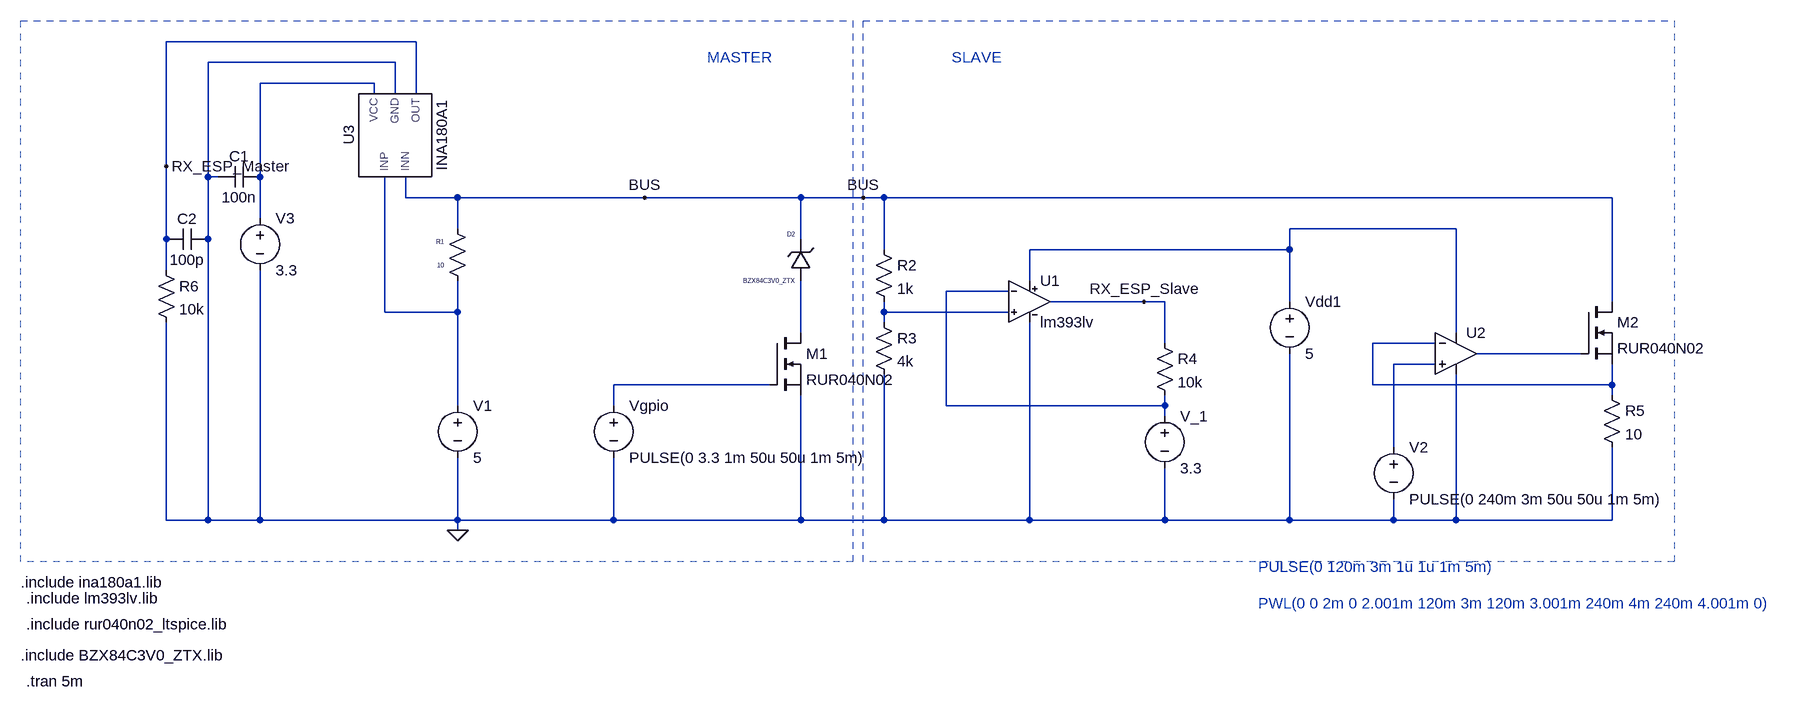
[diagram p0: schematic Master_Slave_INA180A1.asc]
Master_Slave_INA180A1.asc, the LTspice schematic file:
Version 4.1
SHEET 1 2420 728
WIRE -16 -288 -400 -288
WIRE -48 -256 -336 -256
WIRE -80 -224 -256 -224
WIRE -80 -208 -80 -224
WIRE -48 -208 -48 -256
WIRE -16 -208 -16 -288
WIRE -400 -96 -400 -288
WIRE -336 -80 -336 -256
WIRE -320 -80 -336 -80
WIRE -256 -80 -256 -224
WIRE -32 -48 -32 -80
WIRE 48 -48 -32 -48
WIRE 336 -48 48 -48
WIRE 576 -48 336 -48
WIRE 672 -48 576 -48
WIRE 704 -48 672 -48
WIRE 1824 -48 704 -48
WIRE -256 -16 -256 -80
WIRE 48 0 48 -48
WIRE 1584 0 1328 0
WIRE -400 16 -400 -96
WIRE -336 16 -336 -80
WIRE 576 16 576 -48
WIRE 704 32 704 -48
WIRE 1328 32 1328 0
WIRE 1328 32 928 32
WIRE -400 64 -400 16
WIRE 928 80 928 32
WIRE 896 96 800 96
WIRE 1104 112 960 112
WIRE 1136 112 1104 112
WIRE 1328 112 1328 32
WIRE 1824 112 1824 -48
WIRE -64 128 -64 -80
WIRE 48 128 48 80
WIRE 48 128 -64 128
WIRE 704 128 704 112
WIRE 896 128 704 128
WIRE 704 144 704 128
WIRE 576 160 576 80
WIRE 1584 160 1584 0
WIRE 1136 176 1136 112
WIRE 1552 176 1456 176
WIRE 1776 192 1616 192
WIRE 1552 208 1488 208
WIRE 528 240 288 240
WIRE 1456 240 1456 176
WIRE 1824 240 1824 208
WIRE 1824 240 1456 240
WIRE 1824 256 1824 240
WIRE 48 272 48 128
WIRE 288 272 288 240
WIRE 800 272 800 96
WIRE 1136 272 1136 256
WIRE 1136 272 800 272
WIRE 1136 288 1136 272
WIRE 1488 336 1488 208
WIRE -400 448 -400 144
WIRE -336 448 -336 16
WIRE -336 448 -400 448
WIRE -256 448 -256 64
WIRE -256 448 -336 448
WIRE 48 448 48 352
WIRE 48 448 -256 448
WIRE 288 448 288 352
WIRE 288 448 48 448
WIRE 576 448 576 256
WIRE 576 448 288 448
WIRE 704 448 704 224
WIRE 704 448 576 448
WIRE 928 448 928 144
WIRE 928 448 704 448
WIRE 1136 448 1136 368
WIRE 1136 448 928 448
WIRE 1328 448 1328 192
WIRE 1328 448 1136 448
WIRE 1488 448 1488 416
WIRE 1488 448 1328 448
WIRE 1584 448 1584 224
WIRE 1584 448 1488 448
WIRE 1824 448 1824 336
WIRE 1824 448 1584 448
WIRE 48 464 48 448
FLAG 48 464 0
FLAG 336 -48 BUS
FLAG -400 -96 RX_ESP_Master
FLAG 672 -48 BUS
FLAG 1104 112 RX_ESP_Slave
SYMBOL voltage 48 256 R0
SYMATTR InstName V1
SYMATTR Value 5
SYMBOL res 64 96 R180
WINDOW 0 36 76 Left 0
WINDOW 3 36 40 Left 0
SYMATTR InstName R1
SYMATTR Value 10
SYMBOL lib\\sym\\EIT_Semiconductors\\nmos 528 160 R0
SYMATTR InstName M1
SYMATTR Value RUR040N02
SYMATTR Prefix X
SYMBOL voltage 288 256 R0
SYMATTR Value PULSE(0 3.3 1m 50u 50u 1m 5m)
SYMATTR InstName Vgpio
SYMBOL zener 592 80 R180
WINDOW 0 24 72 Left 0
WINDOW 3 24 0 Left 0
SYMATTR InstName D2
SYMATTR Value BZX84C3V0_ZTX
SYMBOL voltage 1328 96 R0
SYMATTR InstName Vdd1
SYMATTR Value 5
SYMBOL voltage 1136 272 R0
SYMATTR InstName V_1
SYMATTR Value 3.3
SYMBOL res 688 16 R0
SYMATTR InstName R2
SYMATTR Value 1k
SYMBOL res 688 128 R0
SYMATTR InstName R3
SYMATTR Value 4k
SYMBOL res 1120 160 R0
SYMATTR InstName R4
SYMATTR Value 10k
SYMBOL LM393 928 112 R0
SYMATTR InstName U1
SYMATTR Value lm393lv
SYMATTR SpiceModel ""
SYMBOL lib\\sym\\EIT_Semiconductors\\nmos 1776 112 R0
SYMATTR InstName M2
SYMATTR Value RUR040N02
SYMATTR Prefix X
SYMBOL res 1808 240 R0
SYMATTR InstName R5
SYMATTR Value 10
SYMBOL lib\\sym\\Opamps\\UniversalOpamp2 1584 192 R0
SYMATTR InstName U2
SYMBOL voltage 1488 320 R0
SYMATTR InstName V2
SYMATTR Value PULSE(0 240m 3m 50u 50u 1m 5m)
SYMBOL INA180A1 -48 -144 R270
SYMATTR InstName U3
SYMBOL voltage -256 -32 R0
SYMATTR InstName V3
SYMATTR Value 3.3
SYMBOL res -416 48 R0
SYMATTR InstName R6
SYMATTR Value 10k
SYMBOL cap -256 -96 R90
WINDOW 0 0 32 VBottom 2
WINDOW 3 32 32 VTop 2
SYMATTR InstName C1
SYMATTR Value 100n
SYMBOL cap -400 32 R270
WINDOW 0 32 32 VTop 2
WINDOW 3 0 32 VBottom 2
SYMATTR InstName C2
SYMATTR Value 100p
TEXT -616 608 Left 2 !.include rur040n02_ltspice.lib
TEXT -624 656 Left 2 !.include BZX84C3V0_ZTX.lib
TEXT -616 696 Left 2 !.tran 5m
TEXT 1280 520 Left 2 ;PULSE(0 120m 3m 1u 1u 1m 5m)
TEXT 1280 576 Left 2 ;PWL(0 0 2m 0 2.001m 120m 3m 120m 3.001m 240m 4m 240m 4.001m 0)
TEXT -616 568 Left 2 !.include lm393lv.lib
TEXT 432 -264 Left 2 ;MASTER
TEXT 808 -264 Left 2 ;SLAVE
TEXT -624 544 Left 2 !.include ina180a1.lib
RECTANGLE Normal 656 512 -624 -320 2
RECTANGLE Normal 1920 512 672 -320 2

The netlist it stands for:
* Master_Slave_INA180A1.asc
V1 N004 0 5
R1 N004 BUS 10
X§M1 N006 N010 0 RUR040N02  ; pins D G S
Vgpio N010 0 PULSE(0 3.3 1m 50u 50u 1m 5m)
D2 N006 BUS BZX84C3V0_ZTX
Vdd1 N002 0 5
V_1 N003 0 3.3
R2 BUS N005 1k
R3 N005 0 4k
R4 RX_ESP_Slave N003 10k
X§U1 N005 N003 N002 0 RX_ESP_Slave lm393lv  ; pins In+ In- V+ V- OUT
X§M2 BUS N008 N007 RUR040N02  ; pins D G S
R5 N007 0 10
X§U2 N009 N007 N002 0 N008 level.2 Avol=1Meg GBW=10Meg Slew=10Meg ilimit=25m rail=0 Vos=0 phimargin=45 en=0 enk=0 in=0 ink=0 Rin=500Meg  ; pins IN+ IN- V+ V- OUT
V2 N009 0 PULSE(0 240m 3m 50u 50u 1m 5m)
X§U3 N004 BUS N001 0 RX_ESP_Master INA180A1  ; pins INP INN VCC GND OUT
V3 N001 0 3.3
R6 RX_ESP_Master 0 10k
C1 N001 0 100n
C2 RX_ESP_Master 0 100p
.model D D
.lib standard.dio
.include rur040n02_ltspice.lib
.include BZX84C3V0_ZTX.lib
.tran 5m
* PULSE(0 120m 3m 1u 1u 1m 5m)
* PWL(0 0 2m 0 2.001m 120m 3m 120m 3.001m 240m 4m 240m 4.001m 0)
.include lm393lv.lib
* MASTER
* SLAVE
.include ina180a1.lib
.lib UniversalOpamps2.sub
.lib ina180a1.lib
.backanno
.end